# Altium schematic sheet V1_USB_sch.SchDoc
size A4; SheetNumber: 4; SheetTotal: 5; SPICEModelCacheQUAUZBGH: <root> / <DocumentId>QUAUZBGH</DocumentId> / <CacheFrame Number="0"> / <Model Name="0805_885012107018_4.7uf" Kind="CKT"> / <Text>******* / .subckt 0805_885012107018_4.7uF 1 2 / Rser 1 3 0.00349429730952 / Lser 2 4 2.52123218E-10 / C1 3 4 0.0000047 / Rpar 3 4 20000000 / .ends 0805_885012107018_4.7uF</Text> / </Model> / </CacheFrame> / </root>
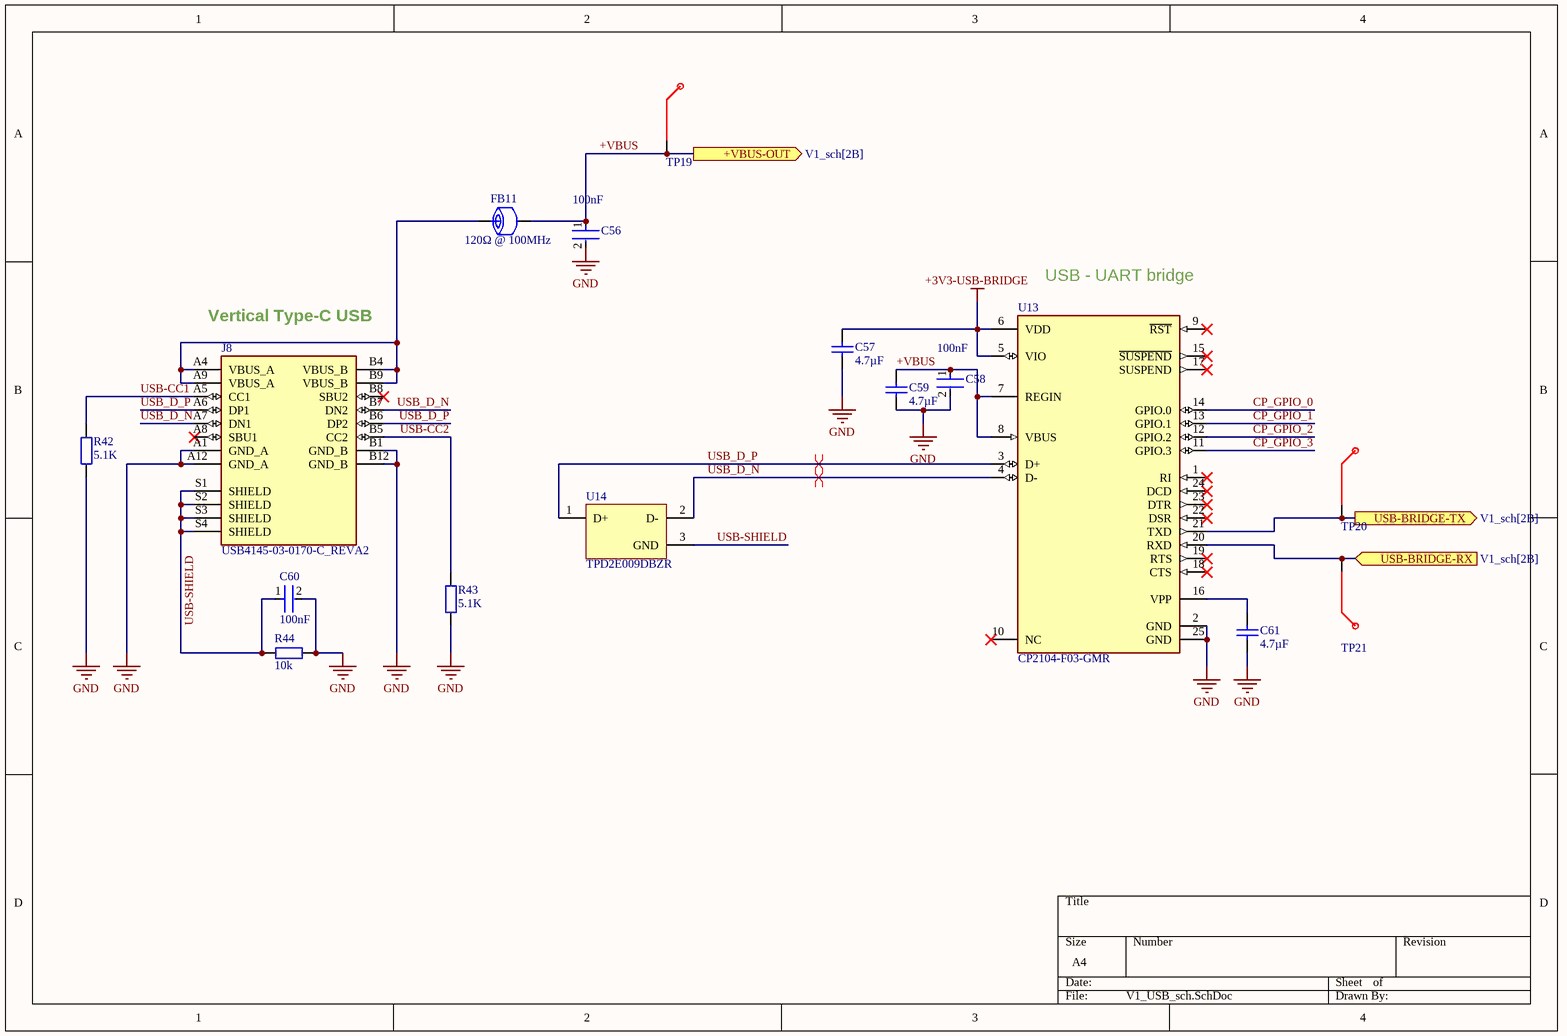
[diagram p0: V1_USB_sch.SchDoc]

## Parts
C56  Capacitance: 100nF  [FP-885012206095-IPC_B]  (hidden comment: 885012206095)
C57  Capacitance: 4.7µF  [WCAP-CSGP_0805_L2W1.25H1.25]  (hidden comment: 885012107018)
C58  Capacitance: 100nF  [FP-885012206095-IPC_B]  (hidden comment: 885012206095)
C59  Capacitance: 4.7µF  [WCAP-CSGP_0805_L2W1.25H1.25]  (hidden comment: 885012107018)
C60  Capacitance: 100nF  [FP-885012206095-IPC_B]  (hidden comment: 885012206095)
C61  Capacitance: 4.7µF  [WCAP-CSGP_0805_L2W1.25H1.25]  (hidden comment: 885012107018)
FB11  120Ω @ 100MHz  [SMD_0805]
J8  USB4145-03-0170-C_REVA2  [GCT_USB4145-03-0170-C_REVA2]
R42  value 5.1K  [FPR_0603_R_R0]  (hidden comment: PN_R0603_5k1)
R43  value 5.1K  [FPR_0603_R_R0]  (hidden comment: PN_R0603_5k1)
R44  value 10k  [FPR_0603_R_R0]  (hidden comment: PN_R0603_10k)
TP19  Test Point  [Test Point 1.5mm SMD]  (value not drawn)
TP20  Test Point  [Test Point 1.5mm SMD]  (value not drawn)
TP21  Test Point  [Test Point 1.5mm SMD]  (value not drawn)
U13  CP2104-F03-GMR  [FP-CP2104-F03-GMR-IPC_A]
U14  TPD2E009DBZR  [DBZ0003A_L]

## Ports
+VBUS-OUT (out, see V1_sch[2B]), USB-BRIDGE-RX (in, see V1_sch[2B]), USB-BRIDGE-TX (out, see V1_sch[2B])

## Nets
+3V3-USB-BRIDGE: C57.2 U13.5(VIO) U13.6(VDD)
GND: C56.2 C57.1 C58.2 C59.1 C60.2 C61.1 J8.A1(GND_A) J8.A12(GND_A) J8.B1(GND_B) J8.B12(GND_B) R42.2 R43.2 R44.1 U13.2(GND) U13.25(GND)
+VBUS: C56.1 C58.1 C59.2 FB11.2 TP19.1 U13.7(REGIN) U13.8(VBUS) ; port +VBUS-OUT
CP_GPIO_0: U13.14(GPIO.0)
CP_GPIO_1: U13.13(GPIO.1)
CP_GPIO_2: U13.12(GPIO.2)
CP_GPIO_3: U13.11(GPIO.3)
USB-BRIDGE-RX: TP21.1 U13.20(RXD) ; port USB-BRIDGE-RX
USB-BRIDGE-TX: TP20.1 U13.21(TXD) ; port USB-BRIDGE-TX
USB-CC1: J8.A5(CC1) R42.1
USB-CC2: J8.B5(CC2) R43.1
USB-SHIELD: C60.1 J8.S1(SHIELD) J8.S2(SHIELD) J8.S3(SHIELD) J8.S4(SHIELD) R44.2 U14.3(GND)
USB_D_N: J8.A7(DN1) J8.B7(DN2) U13.4(D-) U14.2(D-)
USB_D_P: J8.A6(DP1) J8.B6(DP2) U13.3(D+) U14.1(D+)
NetC61_2: C61.2 U13.16(VPP)
NetFB11_1: FB11.1 J8.A4(VBUS_A) J8.A9(VBUS_A) J8.B4(VBUS_B) J8.B9(VBUS_B)

Not connected (* = marked no-connect by the designer): J8 A8(SBU1)* B8(SBU2)*; U13 1(RI)* 9(~{RST})* 10(NC)* 15(~{SUSPEND})* 17(SUSPEND)* 18(CTS)* 19(RTS)* 22(DSR)* 23(DTR)* 24(DCD)*

## Layout directives
differential pair: USB_D_N, USB_D_P

## Notes on the sheet
- (near J8) Vertical Type-C USB
- (near U13) USB - UART bridge

## Library data of the parts
C56 C58 C60 = CMP-207839-000004-1: CAP CER 0.1UF 50V X7R 0603; Tolerance: 10%; RoHS Compliant: Yes; Thickness: 0.037inch; Voltage Rating: 50V; Packaging: Cut Tape; Dielectric: X7R; Series: WCAP-CSGP; Width: 0.031inch; Max Operating Temperature: 125°C; Min Operating Temperature: -55°C; Case/Package: 0603; Case Code (Metric): 1608; Case Code (Imperial): 0603; Length: 0.063inch; Mount: Surface Mount; Voltage Rating (DC): 50V
C57 C59 C61 = 885012107018: WCAP-CSGP Multilayer Ceramic Chip Capacitor, General Purpose, size 0805, X5R, 4.7µF, 25VDC; Manufacturer: Wurth Elektronik; Case/Size Code: 0805; Capacitance Tolerance: +/-20%; Dissipation Factor: 10%; Insulation Resistance: 0.02GΩ; Rated Voltage (DC): 25V; Technical Reference: X5R0805475M025DFCT10000; Manufacturer Part Number: 885012107018; Category: Multilayer Ceramic Chip Capacitors; Match Code: WCAP-CSGP; ComponentLink1Description: Website Link; ComponentLink1URL: https://www.we-online.com/redexpert/article/885012107018?ad; ComponentLink2Description: Datasheet Link; ComponentLink2URL: https://www.we-online.com/redexpert/spec/885012107018?ad; Mount: Surface Mount; Operating Temperature Max: 85°C; Operating Temperature Min: -55°C; Packaging: Tape and Reel; Length: 2mm; Width: 1.25mm; Height: 1.25mm; Ceramic Type: X5R
FB11 = BLM21AG121SN1D: Ferrite Bead, 0805 [2012 Metric], 120 ohm, 800 mA, BLM21A Series, 0.15 ohm, ± 25%; Manufacturer: Murata; Dealer number: 1515617; Dealer: Farnell; DC resistance: 0.15Ω; Max current: 0.2A; Category: ferite beads; Price: 0.082; Manufacturer Number: BLM21AG121SN1D; AC resistance: 120Ω; Frequency: 100MHz; Case: 0805; Technology: SMT; HelpURL: https://www.farnell.com/datasheets/1914683.pdf
R42-R44 = R: Resistor - generic SMD
U13 = CMP-08107-000004-1: IC SGL USB-TO-UART BRIDGE 24QFN; Manufacturer: Silicon Laboratories; Max Supply Voltage: 3.6V; Min Supply Voltage: 1.8V; Nominal Supply Current: 100-17000uA; Standoff Height: 0mm; Interface: UART,USB; Temperature Range Low: -40°C; Lead Free: Yes; Device Class L3: Controllers; Ambient Temperature Range Low: -55°C; Automotive: No; Category: IC; Temperature: -40°C to +85°C; Octopart: https://octopart.com/cp2104-f03-gmr-silicon+labs-19668642; Ambient Temperature Range High: +125°C; Package: CP2104-F03-GMR; Device Class L2: Interface ICs; Digikey Description: IC SGL USB-TO-UART BRIDGE 24QFN; Device Class L1: Integrated Circuits (ICs); Manufacturer Part Number: CP2104-F03-GMR; Temperature Range High: +85°C; ComponentLink2URL: https://www.silabs.com/documents/public/data-sheets/cp2104.pdf; Height: 0.8mm; Ipc Land Pattern Name: QFN50P400X400X75-24; Mouser Description: I/O Controller Interface IC USB to UART bridge; ComponentLink2Description: Datasheet; RoHS: TRUE; LCSC: C47742
U14 = CMP-0326-00068-3: ESD Protection Array for High-Speed Data Interfaces, 2 Channels, -40 to +85 degC, 3-pin SOT-23 (DBZ), Green (RoHS & no Sb/Br); Manufacturer: Texas Instruments; IO Leakage Current(nA): 10; IEC 61000-4-2 Air-Gap(+/- kV): 8; Differential Capacitance(pF): 0.01; Breakdown Voltage(Min)(V): 9; Serial ATA / eSATA: TRUE; SubFamily: ESD Solution; IO Capacitance(Typ)(pF): 0.7; DatasheetVersion: SLVS953A; PackageVersion: revB, Apr-2005; PackageDescription: 3-Pin Plastic Small-Outline Package, 0.95 mm Pitch, 2.4 mm Lead Span; IEC 61000-4-2 Contact(+/- kV): 8; ComponentLink3Description: URL Link1; ComponentLink2Description: Datasheet; ComponentLink3URL: SamplesURL:http://www.ti.com/product/tpd2e009#samples; ComponentLink1Description: Manufacturer URL; PartNumber: TPD2E009DBZR; Eco-Plan: Green (RoHS & no Sb/Br); ComponentLink1URL: http://www.ti.com/; ComponentLink2URL: http://www.ti.com/general/docs/lit/getliterature.tsp?genericPartNumber=TPD2E009&fileType=pdf; Mounting Technology: Surface Mount; PackageReference: DBZ0003A
J8 = USB4145-03-0170-C_REVA2: Price: None; Value: *; Package: None; Availability: Unavailable; MP: USB4145-03-0170-C_REVA2